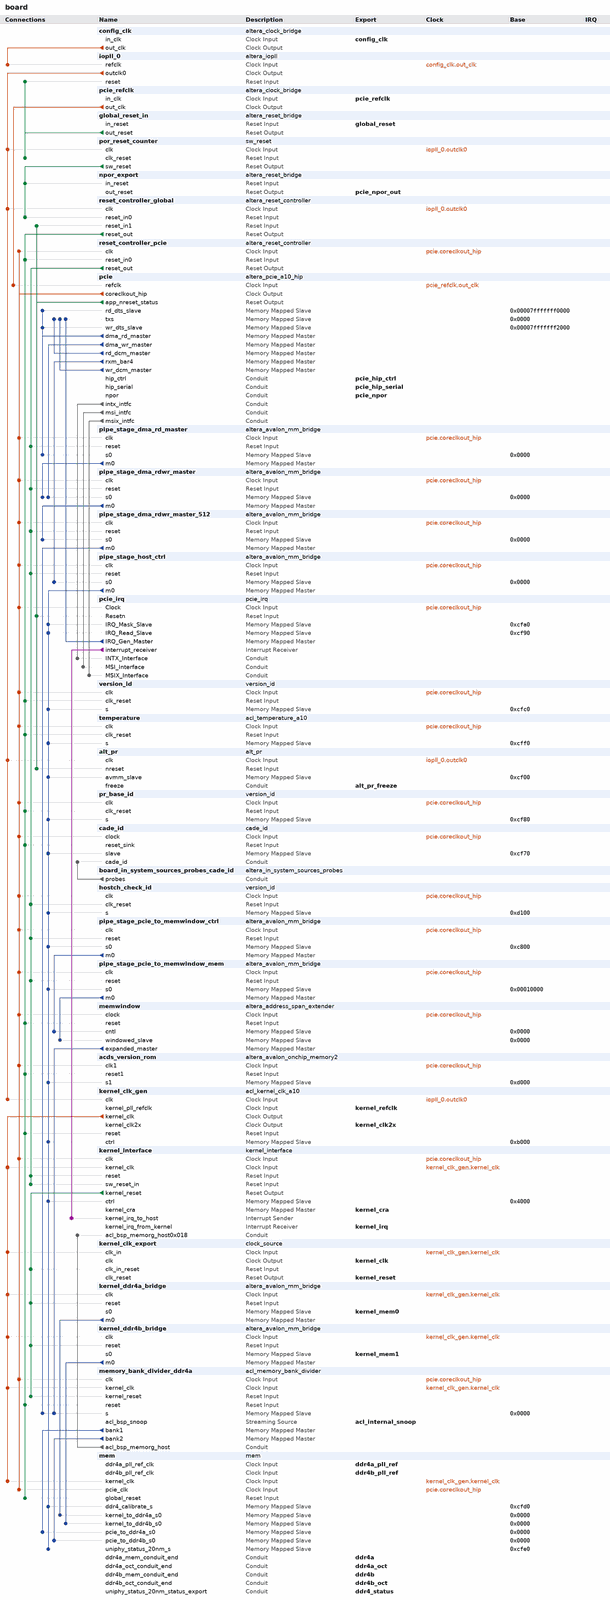
[diagram p0: system contents, whole]
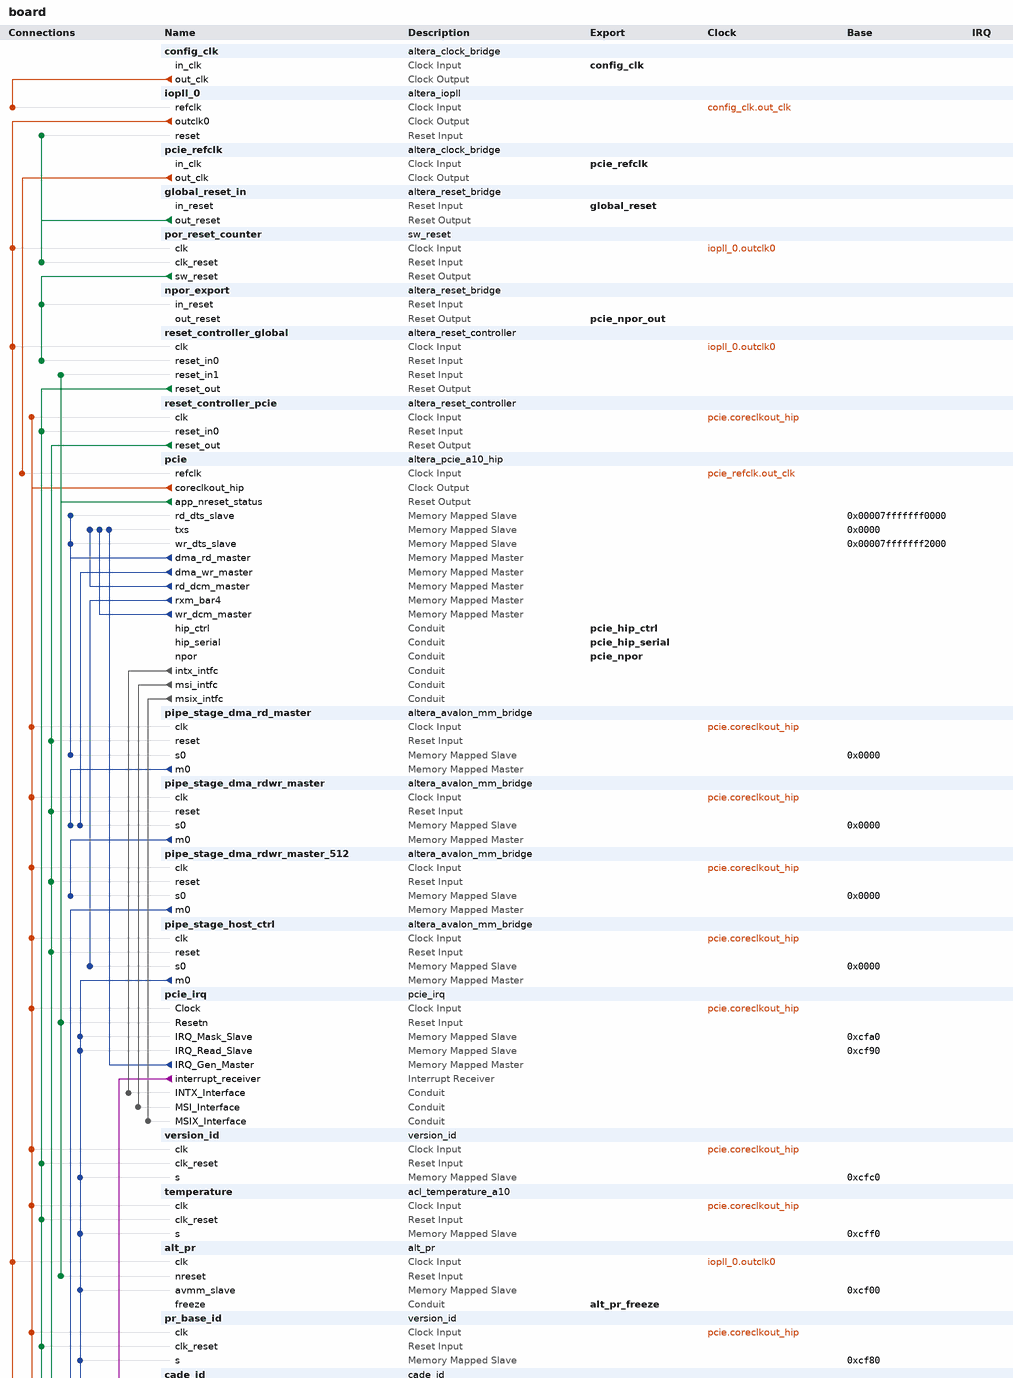
[diagram p1: system contents, upper part]
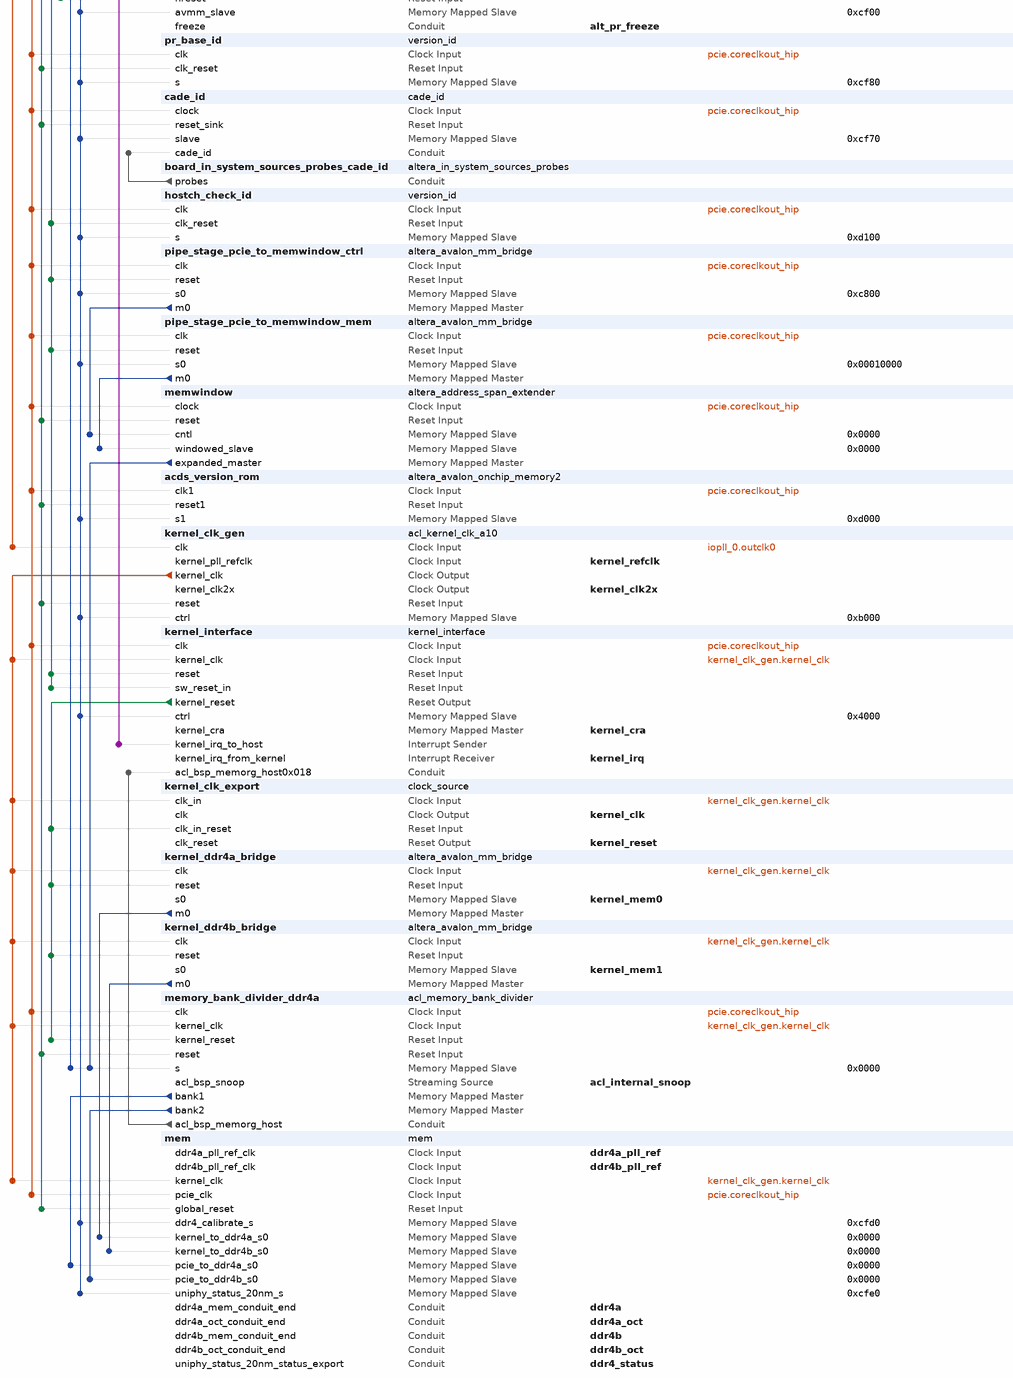
[diagram p2: system contents, lower part]
# Platform Designer (Qsys) system board, Arria 10 10AXF40AA
# Parameters at their usual value, and those the tool derives, are not listed.
package require -exact qsys 1.0
create_system board
set_project_property DEVICE_FAMILY {Arria 10}
set_project_property DEVICE 10AXF40AA

add_component config_clk ip/board/board_config_clk.ip altera_clock_bridge config_clk 18.1
load_component config_clk
set_component_parameter_value DERIVED_CLOCK_RATE 0
set_component_parameter_value EXPLICIT_CLOCK_RATE 100000000
save_component

add_component iopll_0 ip/board/board_iopll_0.ip altera_iopll iopll_0 18.1
load_component iopll_0
set_component_parameter_value gui_device_family {Arria 10}
set_component_parameter_value gui_device_component 10AXF40AA
set_component_parameter_value gui_device_speed_grade 2
set_component_parameter_value gui_debug_mode false
set_component_parameter_value gui_skip_sdc_generation false
set_component_parameter_value gui_include_iossm false
set_component_parameter_value gui_cal_code_hex_file iossm.hex
set_component_parameter_value gui_parameter_table_hex_file seq_params_sim.hex
set_component_parameter_value gui_pll_tclk_mux_en false
set_component_parameter_value gui_pll_tclk_sel pll_tclk_m_src
set_component_parameter_value gui_pll_vco_freq_band_0 pll_freq_clk0_disabled
set_component_parameter_value gui_pll_freqcal_en true
set_component_parameter_value gui_pll_freqcal_req_flag true
set_component_parameter_value gui_cal_converge false
set_component_parameter_value gui_cal_error cal_clean
set_component_parameter_value gui_pll_cal_done false
set_component_parameter_value gui_pll_type S10_Simple
set_component_parameter_value gui_pll_m_cnt_in_src c_m_cnt_in_src_ph_mux_clk
set_component_parameter_value gui_c_cnt_in_src0 c_m_cnt_in_src_ph_mux_clk
set_component_parameter_value system_info_device_component 10AXF40AA
set_component_parameter_value system_info_device_speed_grade 2
set_component_parameter_value system_part_trait_speed_grade 2
set_component_parameter_value gui_usr_device_speed_grade 1
set_component_parameter_value gui_location_type Full-Feature
set_component_parameter_value gui_use_logical false
set_component_parameter_value gui_reference_clock_frequency 100.0
set_component_parameter_value gui_reference_clock_frequency_ps 10000.0
set_component_parameter_value gui_use_coreclk false
set_component_parameter_value gui_refclk_might_change false
set_component_parameter_value gui_prot_mode UNUSED
set_component_parameter_value gui_use_locked false
set_component_parameter_value gui_lock_setting {Low Lock Time}
set_component_parameter_value gui_en_lvds_ports Disabled
set_component_parameter_value gui_operation_mode direct
set_component_parameter_value gui_clock_to_compensate 0
set_component_parameter_value gui_use_NDFB_modes false
set_component_parameter_value gui_number_of_clocks 1
set_component_parameter_value gui_fixed_vco_frequency_ps 1667.0
set_component_parameter_value gui_vco_frequency 600.0
set_component_parameter_value gui_mif_gen_options {Generate New MIF File}
set_component_parameter_value gui_new_mif_file_path {~/pll.mif}
set_component_parameter_value gui_existing_mif_file_path {~/pll.mif}
set_component_parameter_value gui_mif_config_name unnamed
set_component_parameter_value gui_enable_permit_cal false
set_component_parameter_value gui_clock_name_global false
set_component_parameter_value gui_output_clock_frequency0 50.0
set_component_parameter_value gui_output_clock_frequency_ps0 20000.0
set_component_parameter_value gui_actual_output_clock_frequency0 50.0
set_component_parameter_value gui_actual_output_clock_frequency_range0 49.758454,49.777778,49.794239,50.0,50.205761,50.222222
set_component_parameter_value gui_actual_phase_shift0 0.0
set_component_parameter_value gui_actual_phase_shift_range0 0.0,89.3,92.6,96.2,100.0,104.2
set_component_parameter_value gui_actual_phase_shift_deg0 0.0
set_component_parameter_value gui_actual_phase_shift_deg_range0 0.0,1.6,1.7,1.7,1.8,1.9
set_component_parameter_value gui_actual_duty_cycle0 50.0
set_component_parameter_value gui_actual_duty_cycle_range0 47.92,48.08,48.21,50.0,51.79,51.92
set_component_parameter_value parameterTable_names {M-Counter Divide Setting,N-Counter Divide Setting,VCO Frequency,C-Counter-0 Divide Setting,C-Counter-1 Divide Setting,C-Counter-2 Divide Setting,C-Counter-3 Divide Setting,C-Counter-4 Divide Setting,C-Counter-5 Divide Setting,C-Counter-6 Divide Setting,C-Counter-7 Divide Setting,C-Counter-8 Divide Setting,PLL Auto Reset,M-Counter Hi Divide,M-Counter Lo Divide,M-Counter Even Duty Enable,M-Counter Bypass Enable,N-Counter Hi Divide,N-Counter Lo Divide,N-Counter Even Duty Enable,N-Counter Bypass Enable,C-Counter-0 Hi Divide,C-Counter-1 Hi Divide,C-Counter-2 Hi Divide,C-Counter-3 Hi Divide,C-Counter-4 Hi Divide,C-Counter-5 Hi Divide,C-Counter-6 Hi Divide,C-Counter-7 Hi Divide,C-Counter-8 Hi Divide,C-Counter-0 Lo Divide,C-Counter-1 Lo Divide,C-Counter-2 Lo Divide,C-Counter-3 Lo Divide,C-Counter-4 Lo Divide,C-Counter-5 Lo Divide,C-Counter-6 Lo Divide,C-Counter-7 Lo Divide,C-Counter-8 Lo Divide,C-Counter-0 Even Duty Enable,C-Counter-1 Even Duty Enable,C-Counter-2 Even Duty Enable,C-Counter-3 Even Duty Enable,C-Counter-4 Even Duty Enable,C-Counter-5 Even Duty Enable,C-Counter-6 Even Duty Enable,C-Counter-7 Even Duty Enable,C-Counter-8 Even Duty Enable,C-Counter-0 Bypass Enable,C-Counter-1 Bypass Enable,C-Counter-2 Bypass Enable,C-Counter-3 Bypass Enable,C-Counter-4 Bypass Enable,C-Counter-5 Bypass Enable,C-Counter-6 Bypass Enable,C-Counter-7 Bypass Enable,C-Counter-8 Bypass Enable,C-Counter-0 Preset,C-Counter-1 Preset,C-Counter-2 Preset,C-Counter-3 Preset,C-Counter-4 Preset,C-Counter-5 Preset,C-Counter-6 Preset,C-Counter-7 Preset,C-Counter-8 Preset,C-Counter-0 Phase Mux Preset,C-Counter-1 Phase Mux Preset,C-Counter-2 Phase Mux Preset,C-Counter-3 Phase Mux Preset,C-Counter-4 Phase Mux Preset,C-Counter-5 Phase Mux Preset,C-Counter-6 Phase Mux Preset,C-Counter-7 Phase Mux Preset,C-Counter-8 Phase Mux Preset,Charge Pump Current,Bandwidth Control}
set_component_parameter_value parameterTable_values {6,1,600.0 MHz,12,1,1,1,1,1,1,1,1,false,3,3,false,false,256,256,false,true,6,256,256,256,256,256,256,256,256,6,256,256,256,256,256,256,256,256,false,false,false,false,false,false,false,false,false,false,true,true,true,true,true,true,true,true,1,1,1,1,1,1,1,1,1,0,0,0,0,0,0,0,0,0,pll_cp_setting14,pll_bw_res_setting3}
set_component_parameter_value mifTable_names {The MIF file specified does not yet exist}
set_component_parameter_value pll_m_cnt_basic 1
set_component_parameter_value pll_m_cnt 1
set_component_parameter_value prot_mode BASIC
set_component_parameter_value m_cnt_hi_div 3
set_component_parameter_value eff_m_cnt 1
set_component_parameter_value multiply_factor 6
set_component_parameter_value use_core_refclk false
set_component_parameter_value m_cnt_lo_div 3
set_component_parameter_value n_cnt_hi_div 256
set_component_parameter_value n_cnt_lo_div 256
set_component_parameter_value m_cnt_bypass_en false
set_component_parameter_value n_cnt_bypass_en true
set_component_parameter_value m_cnt_odd_div_duty_en false
set_component_parameter_value n_cnt_odd_div_duty_en false
set_component_parameter_value pll_vco_div 1
set_component_parameter_value pll_cp_current pll_cp_setting14
set_component_parameter_value pll_bwctrl pll_bw_res_setting3
set_component_parameter_value pll_fractional_division 1
set_component_parameter_value fractional_vco_multiplier false
set_component_parameter_value reference_clock_frequency {100.0 MHz}
set_component_parameter_value pll_fractional_cout 1
set_component_parameter_value pll_dsm_out_sel 1st_order
set_component_parameter_value operation_mode direct
set_component_parameter_value number_of_clocks 1
set_component_parameter_value number_of_outclks 1
set_component_parameter_value pll_vcoph_div 1
set_component_parameter_value pll_type {Arria 10}
set_component_parameter_value pll_subtype General
set_component_parameter_value pll_output_clk_frequency {600.0 MHz}
set_component_parameter_value pll_pfd_frequency {100.0 MHz}
set_component_parameter_value mimic_fbclk_type gclk
set_component_parameter_value pll_bw_sel Low
set_component_parameter_value pll_slf_rst false
set_component_parameter_value pll_fbclk_mux_1 pll_fbclk_mux_1_glb
set_component_parameter_value pll_fbclk_mux_2 pll_fbclk_mux_2_m_cnt
set_component_parameter_value pll_m_cnt_in_src c_m_cnt_in_src_ph_mux_clk
set_component_parameter_value pll_clkin_0_src clk_0
set_component_parameter_value refclk1_frequency {100.0 MHz}
set_component_parameter_value pll_clk_loss_sw_en false
set_component_parameter_value pll_manu_clk_sw_en false
set_component_parameter_value pll_auto_clk_sw_en false
set_component_parameter_value pll_clkin_1_src clk_0
set_component_parameter_value pll_clk_sw_dly 0
set_component_parameter_value pll_extclk_0_cnt_src pll_extclk_cnt_src_vss
set_component_parameter_value pll_extclk_1_cnt_src pll_extclk_cnt_src_vss
set_component_parameter_value pll_lock_fltr_cfg 100
set_component_parameter_value pll_unlock_fltr_cfg 2
set_component_parameter_value lock_mode low_lock_time
set_component_parameter_value clock_to_compensate 0
set_component_parameter_value clock_name_global false
set_component_parameter_value pll_freqcal_en true
set_component_parameter_value pll_defer_cal_user_mode true
set_component_parameter_value dprio_interface_sel 3
set_component_parameter_value merging_permitted false
set_component_parameter_value c_cnt_hi_div0 6
set_component_parameter_value c_cnt_hi_div1 256
set_component_parameter_value c_cnt_hi_div2 256
set_component_parameter_value c_cnt_hi_div3 256
set_component_parameter_value c_cnt_hi_div4 256
set_component_parameter_value c_cnt_hi_div5 256
set_component_parameter_value c_cnt_hi_div6 256
set_component_parameter_value c_cnt_hi_div7 256
set_component_parameter_value c_cnt_hi_div8 256
set_component_parameter_value c_cnt_hi_div9 1
set_component_parameter_value c_cnt_hi_div10 1
set_component_parameter_value c_cnt_hi_div11 1
set_component_parameter_value c_cnt_hi_div12 1
set_component_parameter_value c_cnt_hi_div13 1
set_component_parameter_value c_cnt_hi_div14 1
set_component_parameter_value c_cnt_hi_div15 1
set_component_parameter_value c_cnt_hi_div16 1
set_component_parameter_value c_cnt_hi_div17 1
set_component_parameter_value c_cnt_lo_div0 6
set_component_parameter_value c_cnt_lo_div1 256
set_component_parameter_value c_cnt_lo_div2 256
set_component_parameter_value c_cnt_lo_div3 256
set_component_parameter_value c_cnt_lo_div4 256
set_component_parameter_value c_cnt_lo_div5 256
set_component_parameter_value c_cnt_lo_div6 256
set_component_parameter_value c_cnt_lo_div7 256
set_component_parameter_value c_cnt_lo_div8 256
set_component_parameter_value c_cnt_lo_div9 1
set_component_parameter_value c_cnt_lo_div10 1
set_component_parameter_value c_cnt_lo_div11 1
set_component_parameter_value c_cnt_lo_div12 1
set_component_parameter_value c_cnt_lo_div13 1
set_component_parameter_value c_cnt_lo_div14 1
set_component_parameter_value c_cnt_lo_div15 1
set_component_parameter_value c_cnt_lo_div16 1
set_component_parameter_value c_cnt_lo_div17 1
set_component_parameter_value c_cnt_prst0 1
set_component_parameter_value c_cnt_prst1 1
set_component_parameter_value c_cnt_prst2 1
set_component_parameter_value c_cnt_prst3 1
set_component_parameter_value c_cnt_prst4 1
set_component_parameter_value c_cnt_prst5 1
set_component_parameter_value c_cnt_prst6 1
set_component_parameter_value c_cnt_prst7 1
set_component_parameter_value c_cnt_prst8 1
set_component_parameter_value c_cnt_prst9 1
set_component_parameter_value c_cnt_prst10 1
set_component_parameter_value c_cnt_prst11 1
set_component_parameter_value c_cnt_prst12 1
set_component_parameter_value c_cnt_prst13 1
set_component_parameter_value c_cnt_prst14 1
set_component_parameter_value c_cnt_prst15 1
set_component_parameter_value c_cnt_prst16 1
set_component_parameter_value c_cnt_prst17 1
set_component_parameter_value c_cnt_ph_mux_prst0 0
set_component_parameter_value c_cnt_ph_mux_prst1 0
set_component_parameter_value c_cnt_ph_mux_prst2 0
set_component_parameter_value c_cnt_ph_mux_prst3 0
set_component_parameter_value c_cnt_ph_mux_prst4 0
set_component_parameter_value c_cnt_ph_mux_prst5 0
set_component_parameter_value c_cnt_ph_mux_prst6 0
set_component_parameter_value c_cnt_ph_mux_prst7 0
set_component_parameter_value c_cnt_ph_mux_prst8 0
set_component_parameter_value c_cnt_ph_mux_prst9 0
set_component_parameter_value c_cnt_ph_mux_prst10 0
set_component_parameter_value c_cnt_ph_mux_prst11 0
set_component_parameter_value c_cnt_ph_mux_prst12 0
set_component_parameter_value c_cnt_ph_mux_prst13 0
set_component_parameter_value c_cnt_ph_mux_prst14 0
set_component_parameter_value c_cnt_ph_mux_prst15 0
set_component_parameter_value c_cnt_ph_mux_prst16 0
set_component_parameter_value c_cnt_ph_mux_prst17 0
set_component_parameter_value c_cnt_in_src0 c_m_cnt_in_src_ph_mux_clk
set_component_parameter_value c_cnt_in_src1 c_m_cnt_in_src_ph_mux_clk
set_component_parameter_value c_cnt_in_src2 c_m_cnt_in_src_ph_mux_clk
set_component_parameter_value c_cnt_in_src3 c_m_cnt_in_src_ph_mux_clk
set_component_parameter_value c_cnt_in_src4 c_m_cnt_in_src_ph_mux_clk
set_component_parameter_value c_cnt_in_src5 c_m_cnt_in_src_ph_mux_clk
set_component_parameter_value c_cnt_in_src6 c_m_cnt_in_src_ph_mux_clk
set_component_parameter_value c_cnt_in_src7 c_m_cnt_in_src_ph_mux_clk
set_component_parameter_value c_cnt_in_src8 c_m_cnt_in_src_ph_mux_clk
set_component_parameter_value c_cnt_in_src9 c_m_cnt_in_src_ph_mux_clk
set_component_parameter_value c_cnt_in_src10 c_m_cnt_in_src_ph_mux_clk
set_component_parameter_value c_cnt_in_src11 c_m_cnt_in_src_ph_mux_clk
set_component_parameter_value c_cnt_in_src12 c_m_cnt_in_src_ph_mux_clk
set_component_parameter_value c_cnt_in_src13 c_m_cnt_in_src_ph_mux_clk
set_component_parameter_value c_cnt_in_src14 c_m_cnt_in_src_ph_mux_clk
set_component_parameter_value c_cnt_in_src15 c_m_cnt_in_src_ph_mux_clk
set_component_parameter_value c_cnt_in_src16 c_m_cnt_in_src_ph_mux_clk
set_component_parameter_value c_cnt_in_src17 c_m_cnt_in_src_ph_mux_clk
set_component_parameter_value c_cnt_bypass_en0 false
set_component_parameter_value c_cnt_bypass_en1 true
set_component_parameter_value c_cnt_bypass_en2 true
set_component_parameter_value c_cnt_bypass_en3 true
set_component_parameter_value c_cnt_bypass_en4 true
set_component_parameter_value c_cnt_bypass_en5 true
set_component_parameter_value c_cnt_bypass_en6 true
set_component_parameter_value c_cnt_bypass_en7 true
set_component_parameter_value c_cnt_bypass_en8 true
set_component_parameter_value c_cnt_bypass_en9 true
set_component_parameter_value c_cnt_bypass_en10 true
set_component_parameter_value c_cnt_bypass_en11 true
set_component_parameter_value c_cnt_bypass_en12 true
set_component_parameter_value c_cnt_bypass_en13 true
set_component_parameter_value c_cnt_bypass_en14 true
set_component_parameter_value c_cnt_bypass_en15 true
set_component_parameter_value c_cnt_bypass_en16 true
set_component_parameter_value c_cnt_bypass_en17 true
set_component_parameter_value c_cnt_odd_div_duty_en0 false
set_component_parameter_value c_cnt_odd_div_duty_en1 false
set_component_parameter_value c_cnt_odd_div_duty_en2 false
set_component_parameter_value c_cnt_odd_div_duty_en3 false
set_component_parameter_value c_cnt_odd_div_duty_en4 false
set_component_parameter_value c_cnt_odd_div_duty_en5 false
set_component_parameter_value c_cnt_odd_div_duty_en6 false
set_component_parameter_value c_cnt_odd_div_duty_en7 false
set_component_parameter_value c_cnt_odd_div_duty_en8 false
set_component_parameter_value c_cnt_odd_div_duty_en9 false
set_component_parameter_value c_cnt_odd_div_duty_en10 false
set_component_parameter_value c_cnt_odd_div_duty_en11 false
set_component_parameter_value c_cnt_odd_div_duty_en12 false
set_component_parameter_value c_cnt_odd_div_duty_en13 false
set_component_parameter_value c_cnt_odd_div_duty_en14 false
set_component_parameter_value c_cnt_odd_div_duty_en15 false
set_component_parameter_value c_cnt_odd_div_duty_en16 false
set_component_parameter_value c_cnt_odd_div_duty_en17 false
set_component_parameter_value output_clock_frequency0 {50.0 MHz}
set_component_parameter_value output_clock_frequency1 {0 ps}
set_component_parameter_value output_clock_frequency2 {0 ps}
set_component_parameter_value output_clock_frequency3 {0 ps}
set_component_parameter_value output_clock_frequency4 {0 ps}
set_component_parameter_value output_clock_frequency5 {0 ps}
set_component_parameter_value output_clock_frequency6 {0 ps}
set_component_parameter_value output_clock_frequency7 {0 ps}
set_component_parameter_value output_clock_frequency8 {0 ps}
set_component_parameter_value output_clock_frequency9 {0 MHz}
set_component_parameter_value output_clock_frequency10 {0 MHz}
set_component_parameter_value output_clock_frequency11 {0 MHz}
set_component_parameter_value output_clock_frequency12 {0 MHz}
set_component_parameter_value output_clock_frequency13 {0 MHz}
set_component_parameter_value output_clock_frequency14 {0 MHz}
set_component_parameter_value output_clock_frequency15 {0 MHz}
set_component_parameter_value output_clock_frequency16 {0 MHz}
set_component_parameter_value output_clock_frequency17 {0 MHz}
set_component_parameter_value phase_shift0 {0 ps}
set_component_parameter_value phase_shift1 {0 ps}
set_component_parameter_value phase_shift2 {0 ps}
set_component_parameter_value phase_shift3 {0 ps}
set_component_parameter_value phase_shift4 {0 ps}
set_component_parameter_value phase_shift5 {0 ps}
set_component_parameter_value phase_shift6 {0 ps}
set_component_parameter_value phase_shift7 {0 ps}
set_component_parameter_value phase_shift8 {0 ps}
set_component_parameter_value phase_shift9 {0 ps}
set_component_parameter_value phase_shift10 {0 ps}
set_component_parameter_value phase_shift11 {0 ps}
set_component_parameter_value phase_shift12 {0 ps}
set_component_parameter_value phase_shift13 {0 ps}
set_component_parameter_value phase_shift14 {0 ps}
set_component_parameter_value phase_shift15 {0 ps}
set_component_parameter_value phase_shift16 {0 ps}
set_component_parameter_value phase_shift17 {0 ps}
set_component_parameter_value duty_cycle0 50
set_component_parameter_value duty_cycle1 50
set_component_parameter_value duty_cycle2 50
set_component_parameter_value duty_cycle3 50
set_component_parameter_value duty_cycle4 50
set_component_parameter_value duty_cycle5 50
set_component_parameter_value duty_cycle6 50
set_component_parameter_value duty_cycle7 50
set_component_parameter_value duty_cycle8 50
set_component_parameter_value duty_cycle9 50
set_component_parameter_value duty_cycle10 50
set_component_parameter_value duty_cycle11 50
set_component_parameter_value duty_cycle12 50
set_component_parameter_value duty_cycle13 50
set_component_parameter_value duty_cycle14 50
set_component_parameter_value duty_cycle15 50
set_component_parameter_value duty_cycle16 50
set_component_parameter_value duty_cycle17 50
set_component_parameter_value clock_name_0 outclk0
set_component_parameter_value clock_name_global_0 false
set_component_parameter_value clock_name_global_1 false
set_component_parameter_value clock_name_global_2 false
set_component_parameter_value clock_name_global_3 false
set_component_parameter_value clock_name_global_4 false
set_component_parameter_value clock_name_global_5 false
set_component_parameter_value clock_name_global_6 false
set_component_parameter_value clock_name_global_7 false
set_component_parameter_value clock_name_global_8 false
set_component_parameter_value divide_factor0 1
set_component_parameter_value divide_factor1 1
set_component_parameter_value divide_factor2 1
set_component_parameter_value divide_factor3 1
set_component_parameter_value divide_factor4 1
set_component_parameter_value divide_factor5 1
set_component_parameter_value divide_factor6 1
set_component_parameter_value divide_factor7 1
set_component_parameter_value divide_factor8 1
set_component_parameter_value pll_tclk_mux_en false
set_component_parameter_value pll_tclk_sel pll_tclk_m_src
set_component_parameter_value pll_vco_freq_band_0 pll_freq_clk0_disabled
set_component_parameter_value pll_vco_freq_band_1 pll_freq_clk1_disabled
set_component_parameter_value pll_freqcal_req_flag true
set_component_parameter_value cal_converge false
set_component_parameter_value cal_error cal_clean
set_component_parameter_value pll_cal_done false
set_component_parameter_value include_iossm false
set_component_parameter_value cal_code_hex_file iossm.hex
set_component_parameter_value parameter_table_hex_file seq_params_sim.hex
set_component_parameter_value iossm_nios_sim_clk_period_ps 1333
set_component_parameter_value hp_number_of_family_allowable_clocks 9
set_component_parameter_value hp_previous_num_clocks 1
set_component_parameter_value hp_actual_vco_frequency_fp 600.0
set_component_parameter_value hp_qsys_scripting_mode false
set_component_parameter_value hp_actual_output_clock_frequency_fp0 50.0
set_component_parameter_value hp_actual_output_clock_frequency_fp1 100.0
set_component_parameter_value hp_actual_output_clock_frequency_fp2 100.0
set_component_parameter_value hp_actual_output_clock_frequency_fp3 100.0
set_component_parameter_value hp_actual_output_clock_frequency_fp4 100.0
set_component_parameter_value hp_actual_output_clock_frequency_fp5 100.0
set_component_parameter_value hp_actual_output_clock_frequency_fp6 100.0
set_component_parameter_value hp_actual_output_clock_frequency_fp7 100.0
set_component_parameter_value hp_actual_output_clock_frequency_fp8 100.0
set_component_parameter_value hp_actual_output_clock_frequency_fp9 100.0
set_component_parameter_value hp_actual_output_clock_frequency_fp10 100.0
set_component_parameter_value hp_actual_output_clock_frequency_fp11 100.0
set_component_parameter_value hp_actual_output_clock_frequency_fp12 100.0
set_component_parameter_value hp_actual_output_clock_frequency_fp13 100.0
set_component_parameter_value hp_actual_output_clock_frequency_fp14 100.0
set_component_parameter_value hp_actual_output_clock_frequency_fp15 100.0
set_component_parameter_value hp_actual_output_clock_frequency_fp16 100.0
set_component_parameter_value hp_actual_output_clock_frequency_fp17 100.0
set_component_parameter_value hp_actual_phase_shift_fp0 0.0
set_component_parameter_value hp_actual_phase_shift_fp1 0.0
set_component_parameter_value hp_actual_phase_shift_fp2 0.0
set_component_parameter_value hp_actual_phase_shift_fp3 0.0
set_component_parameter_value hp_actual_phase_shift_fp4 0.0
set_component_parameter_value hp_actual_phase_shift_fp5 0.0
set_component_parameter_value hp_actual_phase_shift_fp6 0.0
set_component_parameter_value hp_actual_phase_shift_fp7 0.0
set_component_parameter_value hp_actual_phase_shift_fp8 0.0
set_component_parameter_value hp_actual_phase_shift_fp9 0.0
set_component_parameter_value hp_actual_phase_shift_fp10 0.0
set_component_parameter_value hp_actual_phase_shift_fp11 0.0
set_component_parameter_value hp_actual_phase_shift_fp12 0.0
set_component_parameter_value hp_actual_phase_shift_fp13 0.0
set_component_parameter_value hp_actual_phase_shift_fp14 0.0
set_component_parameter_value hp_actual_phase_shift_fp15 0.0
set_component_parameter_value hp_actual_phase_shift_fp16 0.0
set_component_parameter_value hp_actual_phase_shift_fp17 0.0
set_component_parameter_value hp_actual_duty_cycle_fp0 50.0
set_component_parameter_value hp_actual_duty_cycle_fp1 50.0
set_component_parameter_value hp_actual_duty_cycle_fp2 50.0
set_component_parameter_value hp_actual_duty_cycle_fp3 50.0
set_component_parameter_value hp_actual_duty_cycle_fp4 50.0
set_component_parameter_value hp_actual_duty_cycle_fp5 50.0
set_component_parameter_value hp_actual_duty_cycle_fp6 50.0
set_component_parameter_value hp_actual_duty_cycle_fp7 50.0
set_component_parameter_value hp_actual_duty_cycle_fp8 50.0
set_component_parameter_value hp_actual_duty_cycle_fp9 50.0
set_component_parameter_value hp_actual_duty_cycle_fp10 50.0
set_component_parameter_value hp_actual_duty_cycle_fp11 50.0
set_component_parameter_value hp_actual_duty_cycle_fp12 50.0
set_component_parameter_value hp_actual_duty_cycle_fp13 50.0
set_component_parameter_value hp_actual_duty_cycle_fp14 50.0
set_component_parameter_value hp_actual_duty_cycle_fp15 50.0
set_component_parameter_value hp_actual_duty_cycle_fp16 50.0
set_component_parameter_value hp_actual_duty_cycle_fp17 50.0
save_component

add_component pcie_refclk ip/board/board_pcie_refclk.ip altera_clock_bridge pcie_refclk 18.1
load_component pcie_refclk
set_component_parameter_value DERIVED_CLOCK_RATE 0
set_component_parameter_value EXPLICIT_CLOCK_RATE 100000000
save_component

add_component global_reset_in ip/board/board_global_reset_in.ip altera_reset_bridge global_reset_in 18.1
load_component global_reset_in
set_component_parameter_value ACTIVE_LOW_RESET 1
set_component_parameter_value SYNCHRONOUS_EDGES none
set_component_parameter_value SYNC_RESET 0
save_component

add_component por_reset_counter ip/board/board_por_reset_counter.ip sw_reset por_reset_counter 10.0
load_component por_reset_counter
set_component_parameter_value WIDTH 8
set_component_parameter_value LOG2_RESET_CYCLES 10
set_component_parameter_value WIDTH_BYTES 1
save_component

add_component npor_export ip/board/board_npor_export.ip altera_reset_bridge npor_export 18.1
load_component npor_export
set_component_parameter_value ACTIVE_LOW_RESET 1
set_component_parameter_value SYNCHRONOUS_EDGES none
set_component_parameter_value SYNC_RESET 0
save_component

add_component reset_controller_global ip/board/board_reset_controller_global.ip altera_reset_controller reset_controller_global 18.1
load_component reset_controller_global
set_component_parameter_value NUM_RESET_INPUTS 2
set_component_parameter_value SYNC_DEPTH 2
set_component_parameter_value ADAPT_RESET_REQUEST 0
save_component

add_component reset_controller_pcie ip/board/board_reset_controller_pcie.ip altera_reset_controller reset_controller_pcie 18.1
load_component reset_controller_pcie
set_component_parameter_value NUM_RESET_INPUTS 1
set_component_parameter_value SYNC_DEPTH 2
set_component_parameter_value ADAPT_RESET_REQUEST 0
save_component

add_component pcie ip/board/board_pcie.ip altera_pcie_a10_hip pcie 18.1
load_component pcie
set_component_parameter_value interface_type_hwtcl {Avalon-MM with DMA}
set_component_parameter_value force_tag_checking_on_hwtcl 0
set_component_parameter_value app_interface_width_hwtcl 256-bit
set_component_parameter_value wrala_hwtcl 1
set_component_parameter_value base_device NIGHTFURY5
set_component_parameter_value part_trait_device 10AXF40AA
set_component_parameter_value bar0_address_width_mux_hwtcl 9
set_component_parameter_value bar1_address_width_mux_hwtcl 0
set_component_parameter_value bar2_address_width_mux_hwtcl 0
set_component_parameter_value bar3_address_width_mux_hwtcl 0
set_component_parameter_value bar4_address_width_mux_hwtcl 18
set_component_parameter_value bar5_address_width_mux_hwtcl 0
set_component_parameter_value st_signal_width_integer_hwtcl 1
set_component_parameter_value data_width_integer_hwtcl 256
set_component_parameter_value data_width_integer_rxm_txs_hwtcl 32
set_component_parameter_value data_width_integer_txs_hwtcl 32
set_component_parameter_value data_byte_width_integer_hwtcl 32
set_component_parameter_value reconfig_address_width_integer_hwtcl 12
set_component_parameter_value data_byte_width_integer_rxm_txs_hwtcl 4
set_component_parameter_value data_byte_width_integer_txs_hwtcl 4
set_component_parameter_value burst_count_integer_hwtcl 5
set_component_parameter_value empty_integer_hwtcl 2
set_component_parameter_value port_type_integer_hwtcl 0
set_component_parameter_value link_width_integer_hwtcl 4
set_component_parameter_value lane_rate_integer_hwtcl 3
set_component_parameter_value pld_clk_mhz_integer_hwtcl 1250
set_component_parameter_value bar0_type_integer_hwtcl 1
set_component_parameter_value bar1_type_integer_hwtcl 0
set_component_parameter_value bar2_type_integer_hwtcl 0
set_component_parameter_value bar3_type_integer_hwtcl 0
set_component_parameter_value bar4_type_integer_hwtcl 1
set_component_parameter_value bar5_type_integer_hwtcl 0
set_component_parameter_value include_dma_hwtcl 1
set_component_parameter_value txs_addr_width_integer_hwtcl 64
set_component_parameter_value interface_type_integer_hwtcl 1
set_component_parameter_value dma_width_hwtcl 256
set_component_parameter_value dma_be_width_hwtcl 32
set_component_parameter_value dma_brst_cnt_w_hwtcl 5
set_component_parameter_value set_embedded_debug_enable_hwtcl 0
set_component_parameter_value set_capability_reg_enable_hwtcl 0
set_component_parameter_value set_csr_soft_logic_enable_hwtcl 0
set_component_parameter_value set_prbs_soft_logic_enable_hwtcl 0
set_component_parameter_value rcfg_jtag_enable_hwtcl 0
set_component_parameter_value cpl_spc_header_hwtcl 195
set_component_parameter_value cpl_spc_data_hwtcl 773
set_component_parameter_value avmm_addr_width_hwtcl 64
set_component_parameter_value cg_impl_cra_av_slave_port_hwtcl 0
set_component_parameter_value cg_enable_advanced_interrupt_hwtcl 1
set_component_parameter_value cg_enable_a2p_interrupt_hwtcl 0
set_component_parameter_value enable_hip_status_for_avmm_hwtcl 0
set_component_parameter_value internal_controller_hwtcl 1
set_component_parameter_value enable_rxm_burst_hwtcl 0
set_component_parameter_value extended_tag_support_hwtcl 0
set_component_parameter_value user_txs_addr_width_hwtcl 64
set_component_parameter_value cg_a2p_addr_map_num_entries_hwtcl 256
set_component_parameter_value cg_a2p_addr_map_pass_thru_bits_hwtcl 12
set_component_parameter_value link_width_hwtcl x4
set_component_parameter_value lane_rate_hwtcl {Gen3 (8.0 Gbps)}
set_component_parameter_value rx_buffer_credit_alloc_hwtcl Low
set_component_parameter_value rx_buffer_post_credit_alloc_display {Header:n/a Data:n/a}
set_component_parameter_value rx_buffer_nonpost_credit_alloc_display {Header:n/a Data:n/a}
set_component_parameter_value rx_buffer_credit_alloc_display {Header:195 Data:773}
set_component_parameter_value rx_cred_ctl_param_hwtcl 0
set_component_parameter_value set_pld_clk_x1_625MHz_hwtcl 0
set_component_parameter_value enable_avst_reset_hwtcl 0
set_component_parameter_value cseb_config_bypass_gui_hwtcl 0
set_component_parameter_value cseb_config_bypass_hwtcl 0
set_component_parameter_value cseb_autonomous_hwtcl 0
set_component_parameter_value speed_change_hwtcl 0
set_component_parameter_value xcvr_reconfig_hwtcl 0
set_component_parameter_value export_fpll_output_to_top_level_hwtcl 0
set_component_parameter_value export_phy_input_to_top_level_hwtcl 0
set_component_parameter_value enable_lmi_hwtcl 0
set_component_parameter_value adme_enable_hwtcl 0
set_component_parameter_value enable_devkit_conduit_hwtcl 0
set_component_parameter_value enable_skp_det 0
set_component_parameter_value dis_adapt 0
set_component_parameter_value select_design_example_hwtcl DMA
set_component_parameter_value enable_example_design_qii_hwtcl 0
set_component_parameter_value enable_example_design_sim_hwtcl 0
set_component_parameter_value enable_g3_bypass_equlz_rp_sim_hwtcl 0
set_component_parameter_value enable_example_design_synth_hwtcl 0
set_component_parameter_value enable_example_design_tb_hwtcl 0
set_component_parameter_value apps_type_hwtcl 0
set_component_parameter_value select_design_example_rtl_lang_hwtcl Verilog
set_component_parameter_value targeted_devkit_hwtcl {Arria 10 GX FPGA Development Kit}
set_component_parameter_value bar0_type_hwtcl {64-bit prefetchable memory}
set_component_parameter_value bar0_address_width_hwtcl 28
set_component_parameter_value bar1_type_hwtcl Disabled
set_component_parameter_value bar1_address_width_hwtcl 0
set_component_parameter_value bar2_type_hwtcl Disabled
set_component_parameter_value bar2_address_width_hwtcl 0
set_component_parameter_value bar3_type_hwtcl Disabled
set_component_parameter_value bar3_address_width_hwtcl 0
set_component_parameter_value bar4_type_hwtcl {64-bit prefetchable memory}
set_component_parameter_value bar0_address_width_avmm_hwtcl 0
set_component_parameter_value bar1_address_width_avmm_hwtcl 0
set_component_parameter_value bar2_address_width_avmm_hwtcl 0
set_component_parameter_value bar3_address_width_avmm_hwtcl 0
set_component_parameter_value bar4_address_width_avmm_hwtcl 18
set_component_parameter_value bar5_address_width_avmm_hwtcl 0
set_component_parameter_value eco_fb332688_dis_hwtcl 0
set_component_parameter_value vendor_id_hwtcl 4466
set_component_parameter_value device_id_hwtcl 9364
set_component_parameter_value pf0_vf_device_id_hwtcl 0
set_component_parameter_value revision_id_hwtcl 1
set_component_parameter_value class_code_hwtcl 1179649
set_component_parameter_value pf0_subclass_code_hwtcl 0
set_component_parameter_value pf0_pci_prog_intfc_byte_hwtcl 0
set_component_parameter_value subsystem_vendor_id_hwtcl 4466
set_component_parameter_value subsystem_device_id_hwtcl 41297
set_component_parameter_value maximum_payload_size_hwtcl 256
set_component_parameter_value completion_timeout_hwtcl NONE
set_component_parameter_value enable_completion_timeout_disable_hwtcl 1
set_component_parameter_value advance_error_reporting_hwtcl 0
set_component_parameter_value ecrc_check_capable_hwtcl 0
set_component_parameter_value ecrc_gen_capable_hwtcl 0
set_component_parameter_value slot_clock_cfg_hwtcl 1
set_component_parameter_value vsec_id_hwtcl 4466
set_component_parameter_value vsec_cap_hwtcl 0
set_component_parameter_value user_id_hwtcl 0
set_component_parameter_value gen3_coeff_1_hwtcl 8
set_component_parameter_value bfm_drive_interface_clk_hwtcl 1
set_component_parameter_value bfm_drive_interface_npor_hwtcl 1
set_component_parameter_value bfm_drive_interface_pipe_hwtcl 1
set_component_parameter_value bfm_drive_interface_control_hwtcl 1
set_component_parameter_value reserved_debug_hwtcl 0
set_component_parameter_value include_sriov_hwtcl 0
set_component_parameter_value app_msi_req_fn_hwtcl 8
set_component_parameter_value cfg_num_vf_width_hwtcl 8
set_component_parameter_value flr_completed_vf_width_hwtcl 4
set_component_parameter_value sriov2_en 0
set_component_parameter_value virtio_visible 0
set_component_parameter_value enable_nobar_slection_hwtcl 0
set_component_parameter_value enable_custom_features_hwtcl 0
set_component_parameter_value pf0_extra_bar_present_hwtcl 0
set_component_parameter_value pf0_extra_bar_size_hwtcl 12
set_component_parameter_value devhide_support_hwtcl 0
set_component_parameter_value device_embedded_ep_support_hwtcl 0
set_component_parameter_value total_pf_count_hwtcl 1
set_component_parameter_value pf0_vf_count_user_hwtcl 0
set_component_parameter_value pf1_vf_count_user_hwtcl 0
set_component_parameter_value pf2_vf_count_user_hwtcl 0
set_component_parameter_value pf3_vf_count_user_hwtcl 0
set_component_parameter_value pf0_vf_count_hwtcl 0
set_component_parameter_value pf1_vf_count_hwtcl 0
set_component_parameter_value pf2_vf_count_hwtcl 0
set_component_parameter_value pf3_vf_count_hwtcl 0
set_component_parameter_value total_vf_count_hwtcl 4
set_component_parameter_value total_pf_count_width_hwtcl 1
set_component_parameter_value total_vf_count_width_hwtcl 1
set_component_parameter_value system_page_sizes_supported_hwtcl 1363
set_component_parameter_value sr_iov_support_hwtcl 0
set_component_parameter_value include_virtio_capabilities_hwtcl 0
set_component_parameter_value enable_alternate_link_list_hwtcl 0
set_component_parameter_value ari_support_hwtcl 0
set_component_parameter_value flr_capability_user_hwtcl 0
set_component_parameter_value flr_capability_hwtcl 0
set_component_parameter_value pf0_virtio_capability_present_hwtcl 0
set_component_parameter_value pf0_virtio_device_specific_cap_present_hwtcl 0
set_component_parameter_value pf0_virtio_cmn_config_bar_indicator_hwtcl 0
set_component_parameter_value pf0_virtio_cmn_config_bar_offset_hwtcl 0
set_component_parameter_value pf0_virtio_cmn_config_structure_length_hwtcl 0
set_component_parameter_value pf0_virtio_notification_bar_indicator_hwtcl 0
set_component_parameter_value pf0_virtio_notification_bar_offset_hwtcl 0
set_component_parameter_value pf0_virtio_notification_structure_length_hwtcl 0
set_component_parameter_value pf0_virtio_notify_off_multiplier_hwtcl 0
set_component_parameter_value pf0_virtio_isrstatus_bar_indicator_hwtcl 0
set_component_parameter_value pf0_virtio_isrstatus_bar_offset_hwtcl 0
set_component_parameter_value pf0_virtio_isrstatus_structure_length_hwtcl 0
set_component_parameter_value pf0_virtio_devspecific_bar_indicator_hwtcl 0
set_component_parameter_value pf0_virtio_devspecific_bar_offset_hwtcl 0
set_component_parameter_value pf0_virtio_devspecific_structure_length_hwtcl 0
set_component_parameter_value pf0_virtio_pciconfig_access_bar_indicator_hwtcl 0
set_component_parameter_value pf0_virtio_pciconfig_access_bar_offset_hwtcl 0
set_component_parameter_value pf0_virtio_pciconfig_access_structure_length_hwtcl 0
set_component_parameter_value pf1_virtio_capability_present_hwtcl 0
set_component_parameter_value pf1_virtio_device_specific_cap_present_hwtcl 0
set_component_parameter_value pf1_virtio_cmn_config_bar_indicator_hwtcl 0
set_component_parameter_value pf1_virtio_cmn_config_bar_offset_hwtcl 0
set_component_parameter_value pf1_virtio_cmn_config_structure_length_hwtcl 0
set_component_parameter_value pf1_virtio_notification_bar_indicator_hwtcl 0
set_component_parameter_value pf1_virtio_notification_bar_offset_hwtcl 0
set_component_parameter_value pf1_virtio_notification_structure_length_hwtcl 0
set_component_parameter_value pf1_virtio_notify_off_multiplier_hwtcl 0
set_component_parameter_value pf1_virtio_isrstatus_bar_indicator_hwtcl 0
set_component_parameter_value pf1_virtio_isrstatus_bar_offset_hwtcl 0
set_component_parameter_value pf1_virtio_isrstatus_structure_length_hwtcl 0
set_component_parameter_value pf1_virtio_devspecific_bar_indicator_hwtcl 0
set_component_parameter_value pf1_virtio_devspecific_bar_offset_hwtcl 0
set_component_parameter_value pf1_virtio_devspecific_structure_length_hwtcl 0
set_component_parameter_value pf1_virtio_pciconfig_access_bar_indicator_hwtcl 0
set_component_parameter_value pf1_virtio_pciconfig_access_bar_offset_hwtcl 0
set_component_parameter_value pf1_virtio_pciconfig_access_structure_length_hwtcl 0
set_component_parameter_value pf2_virtio_capability_present_hwtcl 0
set_component_parameter_value pf2_virtio_device_specific_cap_present_hwtcl 0
set_component_parameter_value pf2_virtio_cmn_config_bar_indicator_hwtcl 0
set_component_parameter_value pf2_virtio_cmn_config_bar_offset_hwtcl 0
set_component_parameter_value pf2_virtio_cmn_config_structure_length_hwtcl 0
set_component_parameter_value pf2_virtio_notification_bar_indicator_hwtcl 0
set_component_parameter_value pf2_virtio_notification_bar_offset_hwtcl 0
set_component_parameter_value pf2_virtio_notification_structure_length_hwtcl 0
set_component_parameter_value pf2_virtio_notify_off_multiplier_hwtcl 0
set_component_parameter_value pf2_virtio_isrstatus_bar_indicator_hwtcl 0
set_component_parameter_value pf2_virtio_isrstatus_bar_offset_hwtcl 0
set_component_parameter_value pf2_virtio_isrstatus_structure_length_hwtcl 0
set_component_parameter_value pf2_virtio_devspecific_bar_indicator_hwtcl 0
set_component_parameter_value pf2_virtio_devspecific_bar_offset_hwtcl 0
set_component_parameter_value pf2_virtio_devspecific_structure_length_hwtcl 0
set_component_parameter_value pf2_virtio_pciconfig_access_bar_indicator_hwtcl 0
set_component_parameter_value pf2_virtio_pciconfig_access_bar_offset_hwtcl 0
set_component_parameter_value pf2_virtio_pciconfig_access_structure_length_hwtcl 0
set_component_parameter_value pf3_virtio_capability_present_hwtcl 0
set_component_parameter_value pf3_virtio_device_specific_cap_present_hwtcl 0
set_component_parameter_value pf3_virtio_cmn_config_bar_indicator_hwtcl 0
set_component_parameter_value pf3_virtio_cmn_config_bar_offset_hwtcl 0
set_component_parameter_value pf3_virtio_cmn_config_structure_length_hwtcl 0
set_component_parameter_value pf3_virtio_notification_bar_indicator_hwtcl 0
set_component_parameter_value pf3_virtio_notification_bar_offset_hwtcl 0
set_component_parameter_value pf3_virtio_notification_structure_length_hwtcl 0
set_component_parameter_value pf3_virtio_notify_off_multiplier_hwtcl 0
set_component_parameter_value pf3_virtio_isrstatus_bar_indicator_hwtcl 0
set_component_parameter_value pf3_virtio_isrstatus_bar_offset_hwtcl 0
set_component_parameter_value pf3_virtio_isrstatus_structure_length_hwtcl 0
set_component_parameter_value pf3_virtio_devspecific_bar_indicator_hwtcl 0
set_component_parameter_value pf3_virtio_devspecific_bar_offset_hwtcl 0
set_component_parameter_value pf3_virtio_devspecific_structure_length_hwtcl 0
set_component_parameter_value pf3_virtio_pciconfig_access_bar_indicator_hwtcl 0
set_component_parameter_value pf3_virtio_pciconfig_access_bar_offset_hwtcl 0
set_component_parameter_value pf3_virtio_pciconfig_access_structure_length_hwtcl 0
set_component_parameter_value pf4_virtio_capability_present_hwtcl 0
set_component_parameter_value pf4_virtio_device_specific_cap_present_hwtcl 0
set_component_parameter_value pf4_virtio_cmn_config_bar_indicator_hwtcl 0
set_component_parameter_value pf4_virtio_cmn_config_bar_offset_hwtcl 0
set_component_parameter_value pf4_virtio_cmn_config_structure_length_hwtcl 0
set_component_parameter_value pf4_virtio_notification_bar_indicator_hwtcl 0
set_component_parameter_value pf4_virtio_notification_bar_offset_hwtcl 0
set_component_parameter_value pf4_virtio_notification_structure_length_hwtcl 0
set_component_parameter_value pf4_virtio_notify_off_multiplier_hwtcl 0
set_component_parameter_value pf4_virtio_isrstatus_bar_indicator_hwtcl 0
set_component_parameter_value pf4_virtio_isrstatus_bar_offset_hwtcl 0
set_component_parameter_value pf4_virtio_isrstatus_structure_length_hwtcl 0
set_component_parameter_value pf4_virtio_devspecific_bar_indicator_hwtcl 0
set_component_parameter_value pf4_virtio_devspecific_bar_offset_hwtcl 0
set_component_parameter_value pf4_virtio_devspecific_structure_length_hwtcl 0
set_component_parameter_value pf4_virtio_pciconfig_access_bar_indicator_hwtcl 0
set_component_parameter_value pf4_virtio_pciconfig_access_bar_offset_hwtcl 0
set_component_parameter_value pf4_virtio_pciconfig_access_structure_length_hwtcl 0
set_component_parameter_value pf5_virtio_capability_present_hwtcl 0
set_component_parameter_value pf5_virtio_device_specific_cap_present_hwtcl 0
set_component_parameter_value pf5_virtio_cmn_config_bar_indicator_hwtcl 0
set_component_parameter_value pf5_virtio_cmn_config_bar_offset_hwtcl 0
set_component_parameter_value pf5_virtio_cmn_config_structure_length_hwtcl 0
set_component_parameter_value pf5_virtio_notification_bar_indicator_hwtcl 0
set_component_parameter_value pf5_virtio_notification_bar_offset_hwtcl 0
set_component_parameter_value pf5_virtio_notification_structure_length_hwtcl 0
set_component_parameter_value pf5_virtio_notify_off_multiplier_hwtcl 0
set_component_parameter_value pf5_virtio_isrstatus_bar_indicator_hwtcl 0
set_component_parameter_value pf5_virtio_isrstatus_bar_offset_hwtcl 0
set_component_parameter_value pf5_virtio_isrstatus_structure_length_hwtcl 0
set_component_parameter_value pf5_virtio_devspecific_bar_indicator_hwtcl 0
set_component_parameter_value pf5_virtio_devspecific_bar_offset_hwtcl 0
set_component_parameter_value pf5_virtio_devspecific_structure_length_hwtcl 0
set_component_parameter_value pf5_virtio_pciconfig_access_bar_indicator_hwtcl 0
set_component_parameter_value pf5_virtio_pciconfig_access_bar_offset_hwtcl 0
set_component_parameter_value pf5_virtio_pciconfig_access_structure_length_hwtcl 0
set_component_parameter_value pf6_virtio_capability_present_hwtcl 0
set_component_parameter_value pf6_virtio_device_specific_cap_present_hwtcl 0
set_component_parameter_value pf6_virtio_cmn_config_bar_indicator_hwtcl 0
set_component_parameter_value pf6_virtio_cmn_config_bar_offset_hwtcl 0
set_component_parameter_value pf6_virtio_cmn_config_structure_length_hwtcl 0
set_component_parameter_value pf6_virtio_notification_bar_indicator_hwtcl 0
set_component_parameter_value pf6_virtio_notification_bar_offset_hwtcl 0
set_component_parameter_value pf6_virtio_notification_structure_length_hwtcl 0
set_component_parameter_value pf6_virtio_notify_off_multiplier_hwtcl 0
set_component_parameter_value pf6_virtio_isrstatus_bar_indicator_hwtcl 0
set_component_parameter_value pf6_virtio_isrstatus_bar_offset_hwtcl 0
set_component_parameter_value pf6_virtio_isrstatus_structure_length_hwtcl 0
set_component_parameter_value pf6_virtio_devspecific_bar_indicator_hwtcl 0
set_component_parameter_value pf6_virtio_devspecific_bar_offset_hwtcl 0
set_component_parameter_value pf6_virtio_devspecific_structure_length_hwtcl 0
set_component_parameter_value pf6_virtio_pciconfig_access_bar_indicator_hwtcl 0
set_component_parameter_value pf6_virtio_pciconfig_access_bar_offset_hwtcl 0
set_component_parameter_value pf6_virtio_pciconfig_access_structure_length_hwtcl 0
set_component_parameter_value pf7_virtio_capability_present_hwtcl 0
set_component_parameter_value pf7_virtio_device_specific_cap_present_hwtcl 0
set_component_parameter_value pf7_virtio_cmn_config_bar_indicator_hwtcl 0
set_component_parameter_value pf7_virtio_cmn_config_bar_offset_hwtcl 0
set_component_parameter_value pf7_virtio_cmn_config_structure_length_hwtcl 0
set_component_parameter_value pf7_virtio_notification_bar_indicator_hwtcl 0
set_component_parameter_value pf7_virtio_notification_bar_offset_hwtcl 0
set_component_parameter_value pf7_virtio_notification_structure_length_hwtcl 0
set_component_parameter_value pf7_virtio_notify_off_multiplier_hwtcl 0
set_component_parameter_value pf7_virtio_isrstatus_bar_indicator_hwtcl 0
set_component_parameter_value pf7_virtio_isrstatus_bar_offset_hwtcl 0
set_component_parameter_value pf7_virtio_isrstatus_structure_length_hwtcl 0
set_component_parameter_value pf7_virtio_devspecific_bar_indicator_hwtcl 0
set_component_parameter_value pf7_virtio_devspecific_bar_offset_hwtcl 0
set_component_parameter_value pf7_virtio_devspecific_structure_length_hwtcl 0
set_component_parameter_value pf7_virtio_pciconfig_access_bar_indicator_hwtcl 0
set_component_parameter_value pf7_virtio_pciconfig_access_bar_offset_hwtcl 0
set_component_parameter_value pf7_virtio_pciconfig_access_structure_length_hwtcl 0
set_component_parameter_value pf0vf_virtio_capability_present_hwtcl 0
set_component_parameter_value pf0vf_virtio_device_specific_cap_present_hwtcl 0
set_component_parameter_value pf0vf_virtio_cmn_config_bar_indicator_hwtcl 0
set_component_parameter_value pf0vf_virtio_cmn_config_bar_offset_hwtcl 0
set_component_parameter_value pf0vf_virtio_cmn_config_structure_length_hwtcl 0
set_component_parameter_value pf0vf_virtio_notification_bar_indicator_hwtcl 0
set_component_parameter_value pf0vf_virtio_notification_bar_offset_hwtcl 0
set_component_parameter_value pf0vf_virtio_notification_structure_length_hwtcl 0
set_component_parameter_value pf0vf_virtio_notify_off_multiplier_hwtcl 0
set_component_parameter_value pf0vf_virtio_isrstatus_bar_indicator_hwtcl 0
set_component_parameter_value pf0vf_virtio_isrstatus_bar_offset_hwtcl 0
set_component_parameter_value pf0vf_virtio_isrstatus_structure_length_hwtcl 0
set_component_parameter_value pf0vf_virtio_devspecific_bar_indicator_hwtcl 0
set_component_parameter_value pf0vf_virtio_devspecific_bar_offset_hwtcl 0
set_component_parameter_value pf0vf_virtio_devspecific_structure_length_hwtcl 0
set_component_parameter_value pf0vf_virtio_pciconfig_access_bar_indicator_hwtcl 0
set_component_parameter_value pf0vf_virtio_pciconfig_access_bar_offset_hwtcl 0
set_component_parameter_value pf0vf_virtio_pciconfig_access_structure_length_hwtcl 0
set_component_parameter_value pf1vf_virtio_capability_present_hwtcl 0
set_component_parameter_value pf1vf_virtio_device_specific_cap_present_hwtcl 0
set_component_parameter_value pf1vf_virtio_cmn_config_bar_indicator_hwtcl 0
set_component_parameter_value pf1vf_virtio_cmn_config_bar_offset_hwtcl 0
set_component_parameter_value pf1vf_virtio_cmn_config_structure_length_hwtcl 0
set_component_parameter_value pf1vf_virtio_notification_bar_indicator_hwtcl 0
set_component_parameter_value pf1vf_virtio_notification_bar_offset_hwtcl 0
set_component_parameter_value pf1vf_virtio_notification_structure_length_hwtcl 0
set_component_parameter_value pf1vf_virtio_notify_off_multiplier_hwtcl 0
set_component_parameter_value pf1vf_virtio_isrstatus_bar_indicator_hwtcl 0
set_component_parameter_value pf1vf_virtio_isrstatus_bar_offset_hwtcl 0
set_component_parameter_value pf1vf_virtio_isrstatus_structure_length_hwtcl 0
set_component_parameter_value pf1vf_virtio_devspecific_bar_indicator_hwtcl 0
set_component_parameter_value pf1vf_virtio_devspecific_bar_offset_hwtcl 0
set_component_parameter_value pf1vf_virtio_devspecific_structure_length_hwtcl 0
set_component_parameter_value pf1vf_virtio_pciconfig_access_bar_indicator_hwtcl 0
set_component_parameter_value pf1vf_virtio_pciconfig_access_bar_offset_hwtcl 0
set_component_parameter_value pf1vf_virtio_pciconfig_access_structure_length_hwtcl 0
set_component_parameter_value pf2vf_virtio_capability_present_hwtcl 0
set_component_parameter_value pf2vf_virtio_device_specific_cap_present_hwtcl 0
set_component_parameter_value pf2vf_virtio_cmn_config_bar_indicator_hwtcl 0
set_component_parameter_value pf2vf_virtio_cmn_config_bar_offset_hwtcl 0
set_component_parameter_value pf2vf_virtio_cmn_config_structure_length_hwtcl 0
